# EAGLE schematic board (EAGLE 9.5.2)
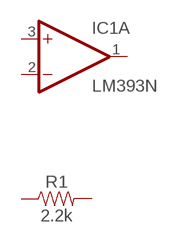
[diagram p0: schematic, sheet 1]

## Parts
IC1  LM393N  [DIL08]
R1  2.2k  2.2KOHM-0603-1/10W-1%  [0603]
Unconnected: IC1.1(A:OUT) IC1.2(A:-IN) IC1.3(A:+IN) IC1.5(B:+IN) IC1.6(B:-IN) IC1.7(B:OUT) R1.1 R1.2

## Power pins joined to a net without a drawn wire
V+: IC1.8(P:V+)
V-: IC1.4(P:V-)

## Library data of the parts
IC1 = linear:LM393: COMPARATOR
R1 = SparkFun-Resistors:2.2KOHM: 2.2kΩ resistor A resistor is a passive two-terminal electrical component that implements electrical resistance as a circuit element. Resistors act to reduce current flow, and, at the same time, act to lower voltage levels within circuits. - Wikipedia; PROD_ID: RES-08272